# Altium schematic sheet OUTPUTS.SchDoc
size A4
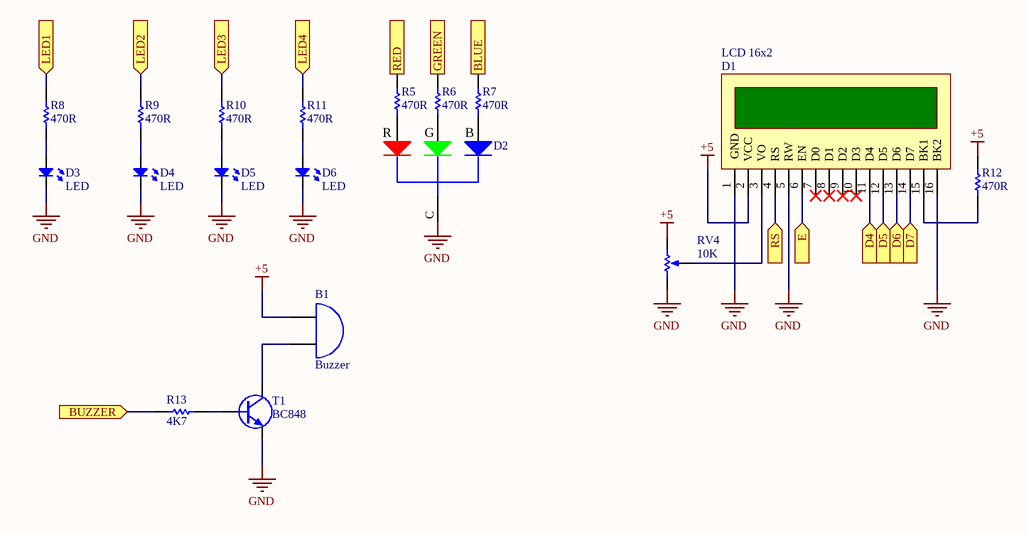
[diagram p0: OUTPUTS.SchDoc]

## Parts
B1  Buzzer  [Buzzer]
D1  LCD 16x2  [LCD_16X2]
D2  Led RGB  [RGB-5mm]  (value not drawn)
D3  LED  [LED_GREEN]
D4  LED  [LED_GREEN]
D5  LED  [LED_GREEN]
D6  LED  [LED_GREEN]
R5  470R  [SMD Resistor]
R6  470R  [SMD Resistor]
R7  470R  [SMD Resistor]
R8  470R  [SMD Resistor]
R9  470R  [SMD Resistor]
R10  470R  [SMD Resistor]
R11  470R  [SMD Resistor]
R12  470R  [SMD Resistor]
R13  4K7  [SMD Resistor]
RV4  10K  [Trimpot]
T1  BC848  [SOT-23]

## Ports
BLUE (in), BUZZER (in), D4 (in), D5 (in), D6 (in), D7 (in), E (in), GREEN (in), LED1 (in), LED2 (in), LED3 (in), LED4 (in), RED (in), RS (in)

## Nets
+5: B1.1(A) D1.2(VCC) R12.2 RV4.3(BOT)
GND: D1.1(GND) D1.5(RW) D1.16(BK2) D2.C D3.K D4.K D5.K D6.K RV4.1(TOP) T1.3(E)
BLUE: R7.2 ; port BLUE
BUZZER: R13.1 ; port BUZZER
D4: D1.11(D4) ; port D4
D5: D1.12(D5) ; port D5
D6: D1.13(D6) ; port D6
D7: D1.14(D7) ; port D7
E: D1.6(EN) ; port E
GREEN: R6.2 ; port GREEN
LED1: R8.2 ; port LED1
LED2: R9.2 ; port LED2
LED3: R10.2 ; port LED3
LED4: R11.2 ; port LED4
RED: R5.2 ; port RED
RS: D1.4(RS) ; port RS
NetB1_2: B1.2(B) T1.1(C)
NetD1_3: D1.3(VO) RV4.2(TAP)
NetD1_15: D1.15(BK1) R12.1
NetD2_B: D2.B R7.1
NetD2_G: D2.G R6.1
NetD2_R: D2.R R5.1
NetD3_A: D3.A R8.1
NetD4_A: D4.A R9.1
NetD5_A: D5.A R10.1
NetD6_A: D6.A R11.1
NetR13_2: R13.2 T1.2(B)

Not connected (* = marked no-connect by the designer): D1 7(D0)* 8(D1)* 9(D2)* 10(D3)*

## Library data of the parts
B1 = Buzzer: Piezoeletric; Manufacturer: Projects Unlimited; Manufacturer Part Number: AT-1224-TWT-5V-2-R; Voltage Rating: 5V; Frequency: 2.4kHz; Operating Supply Current: 40mA; Sensing Method: Magnetic; Supplier 1: Digi-Key; Stock 1: 74074; Pricing 1: 1=0.6, 10=0.478, 25=0.436, 50=0.406, 100=0.38, 250=0.346, 500=0.324, 1000=0.302, 5000=0.256 (USD); Mount: Through Hole; Contact Plating: Tin; Min Operating Temperature: -30°C; Max Operating Temperature: 70°C; Packaging: Tray; Termination: PC Pins; Max Supply Current: 40mA; Diameter: 12mm; Height: 9mm; ComponentLink1URL: http://www.mouser.com/ds/2/334/AT-1224-TWT-5V-2-R-532234.pdf; ComponentLink1Description: http://www.mouser.com/ds/2/334/AT-1224-TWT-5V-2-R-532234.pdf; ComponentLink2URL: http://www.puiaudio.com/pdf/AT-1224-TWT-5V-2-R.pdf; ComponentLink2Description: http://www.puiaudio.com/pdf/AT-1224-TWT-5V-2-R.pdf; Supplier Part Number 1: 668-1470-ND
D1 = LCD_16x2: Liquid Crystal Display 16x2; Manufacturer: Lumex; Manufacturer Part Number: LCM-S01602DSR/A; Operating Supply Voltage: 5V; Interface: Parallel; Number of Characters: 32; Character Width: 2.96mm; Character Height: 5.56mm; Viewing Area (height): 16mm; Current Rating: 3mA; Viewing Area (width): 66mm; Background Colour: Green; Number Of Characters Per Row: 16; Supplier 1: Digi-Key; Stock 1: 2202; Pricing 1: 1=11.92, 10=11.417, 25=8.8796, 100=7.611, 250=7.2304, 500=6.8499, 1000=6.4694 (USD); Case/Package: Module; Weight: 0.0025lb; Min Operating Temperature: 0°C; Max Operating Temperature: 50°C; Package Quantity: 45; Packaging: Bulk; Voltage Rating: 5V; Length: 0.25inch; Height: 36mm; Width: 80mm; REACH SVHC: No SVHC; Lead Free: Lead Free; ComponentLink1URL: https://datasheet.ciiva.com/2102/lcm-s01602dsr+a-2102193.pdf; ComponentLink1Description: https://datasheet.ciiva.com/2102/lcm-s01602dsr+a-2102193.pdf; ComponentLink2URL: https://datasheet.ciiva.com/1314/710199-1314420.pdf; ComponentLink2Description: https://datasheet.ciiva.com/1314/710199-1314420.pdf; Supplier Part Number 1: 67-1768-ND
D2 = RGB: Led RGB 4 pin Cathode Commom
D3-D6 = LED-GREEN: Light Emissor Diode - 5mm; Manufacturer: Kingbright; Manufacturer Part Number: WP7113LGD; Colour: Green; Lens Style: Round,Diffused,Tinted; Luminous Intensity: 2mcd; Viewing Angle: 30°; Forward Voltage: 1.9V; Forward Current: 25mA; Dominant Wavelength: 568nm; Test Current: 2mA; Supplier 1: Digi-Key; Stock 1: 193634; Pricing 1: 1=0.48, 10=0.342, 25=0.2624, 100=0.171, 250=0.1254, 500=0.1064, 1000=0.0874, 2500=0.076, 5000=0.0684 (USD); Mount: Through Hole; Case/Package: Radial; Lens Colour: Green; Min Operating Temperature: -40°C; Max Operating Temperature: 85°C; Illumination Colour: Green; Packaging: Bulk; Package Quantity: 1000; Height: 8.6mm; Lead Free: Lead Free; ComponentLink1URL: https://datasheet.ciiva.com/16510/wp7113lgd-16510240.pdf; ComponentLink1Description: https://datasheet.ciiva.com/16510/wp7113lgd-16510240.pdf; ComponentLink2URL: https://datasheet.ciiva.com/4692/wp7113lgd-83708-4692822.pdf; ComponentLink2Description: https://datasheet.ciiva.com/4692/wp7113lgd-83708-4692822.pdf; ComponentLink3URL: https://datasheet.ciiva.com/14604/70062982-14604412.pdf; ComponentLink3Description: https://datasheet.ciiva.com/14604/70062982-14604412.pdf; ComponentLink4URL: https://datasheet.ciiva.com/2114/wp7113lgd-2114397.pdf; ComponentLink4Description: https://datasheet.ciiva.com/2114/wp7113lgd-2114397.pdf; Supplier Part Number 1: 754-1265-ND
R5-R13 = SMD Resistor: SMD Resistor  MCU 0805
RV4 = Trimpot: TRIMMER 10K OHM 0.5W TH; Manufacturer: Murata; Manufacturer Part Number: PV36W103C01B00; Resistance: 10kR; Tolerance: 10%; Number of Turns: 25; Max Power Dissipation: 500mW; Temperature Coefficient: 100ppm/°C; Pitch: 2.5mm; Supplier 1: Arrow; Stock 1: 0; Pricing 1: 1=0.78 (EUR); Mount: Through Hole; Weight: 1g; Colour: Grey; Min Operating Temperature: -55°C; Max Operating Temperature: 125°C; Packaging: Bulk; Composition: Cermet; Termination: Pin; Power Rating: 500mW; Package Quantity: 50; Taper: Linear; Military Standard: Not; Type: Potentiometer; Length: 9.6mm; Height: 0.394inch; Width: 10mm; Depth: 5mm; Radiation Hardening: No; REACH SVHC: No SVHC; Lead Free: Lead Free; ComponentLink1URL: https://datasheet.ciiva.com/2155/l0060e-2155893.pdf; ComponentLink1Description: https://datasheet.ciiva.com/2155/l0060e-2155893.pdf; ComponentLink2URL: https://datasheet.ciiva.com/27054/1875466-27054391.pdf; ComponentLink2Description: https://datasheet.ciiva.com/27054/1875466-27054391.pdf; ComponentLink3URL: https://datasheet.ciiva.com/11830/0900766b80f10a07-11830940.pdf; ComponentLink3Description: https://datasheet.ciiva.com/11830/0900766b80f10a07-11830940.pdf; ComponentLink4URL: https://datasheet.ciiva.com/16480/r50e-16480015.pdf; ComponentLink4Description: https://datasheet.ciiva.com/16480/r50e-16480015.pdf; ComponentLink5URL: https://datasheet.ciiva.com/26329/422323-da-01-en-cermet-trimmer-pv-36w-10k0-10pr-26329725.pdf; ComponentLink5Description: https://datasheet.ciiva.com/26329/422323-da-01-en-cermet-trimmer-pv-36w-10k0-10pr-26329725.pdf; Supplier Part Number 1: PV36W103C01B00
T1 = BC848: NPN Epitaxial Silicon Transistor.; Manufacturer: ON Semiconductor; Manufacturer Part Number: BC848BLT3G; Collector Emitter Voltage (VCEO): 30V; Max Power Dissipation: 300mW; Frequency: 100MHz; hFE Min: 200; Max Collector Current: 100mA; Emitter Base Voltage (VEBO): 5V; Collector Emitter Saturation Voltage: 600mV; Number of Elements: 1; Element Configuration: Single; Supplier 1: Digi-Key; Stock 1: 29910; Pricing 1: 1=0.12, 10=0.105, 100=0.0572, 500=0.0352, 1000=0.024 (USD); Case/Package: SOT-23-3; Number of Pins: 3; Min Operating Temperature: -55°C; Max Operating Temperature: 150°C; Package Quantity: 10000; Packaging: Tape and Reel; Transition Frequency: 100MHz; Collector Emitter Breakdown Voltage: 30V; Polarity: NPN; Collector Base Voltage (VCBO): 30V; Max Breakdown Voltage: 30V; Power Dissipation: 300mW; Gain Bandwidth Product: 100MHz; Voltage Rating (DC): 30V; Current Rating: 100mA; Radiation Hardening: No; Lead Free: Lead Free; Supplier Part Number 1: BC848BLT3GOSDKR-ND